# Altium schematic sheet PCI short card universal - 32 BIT-7.schdoc
size A3
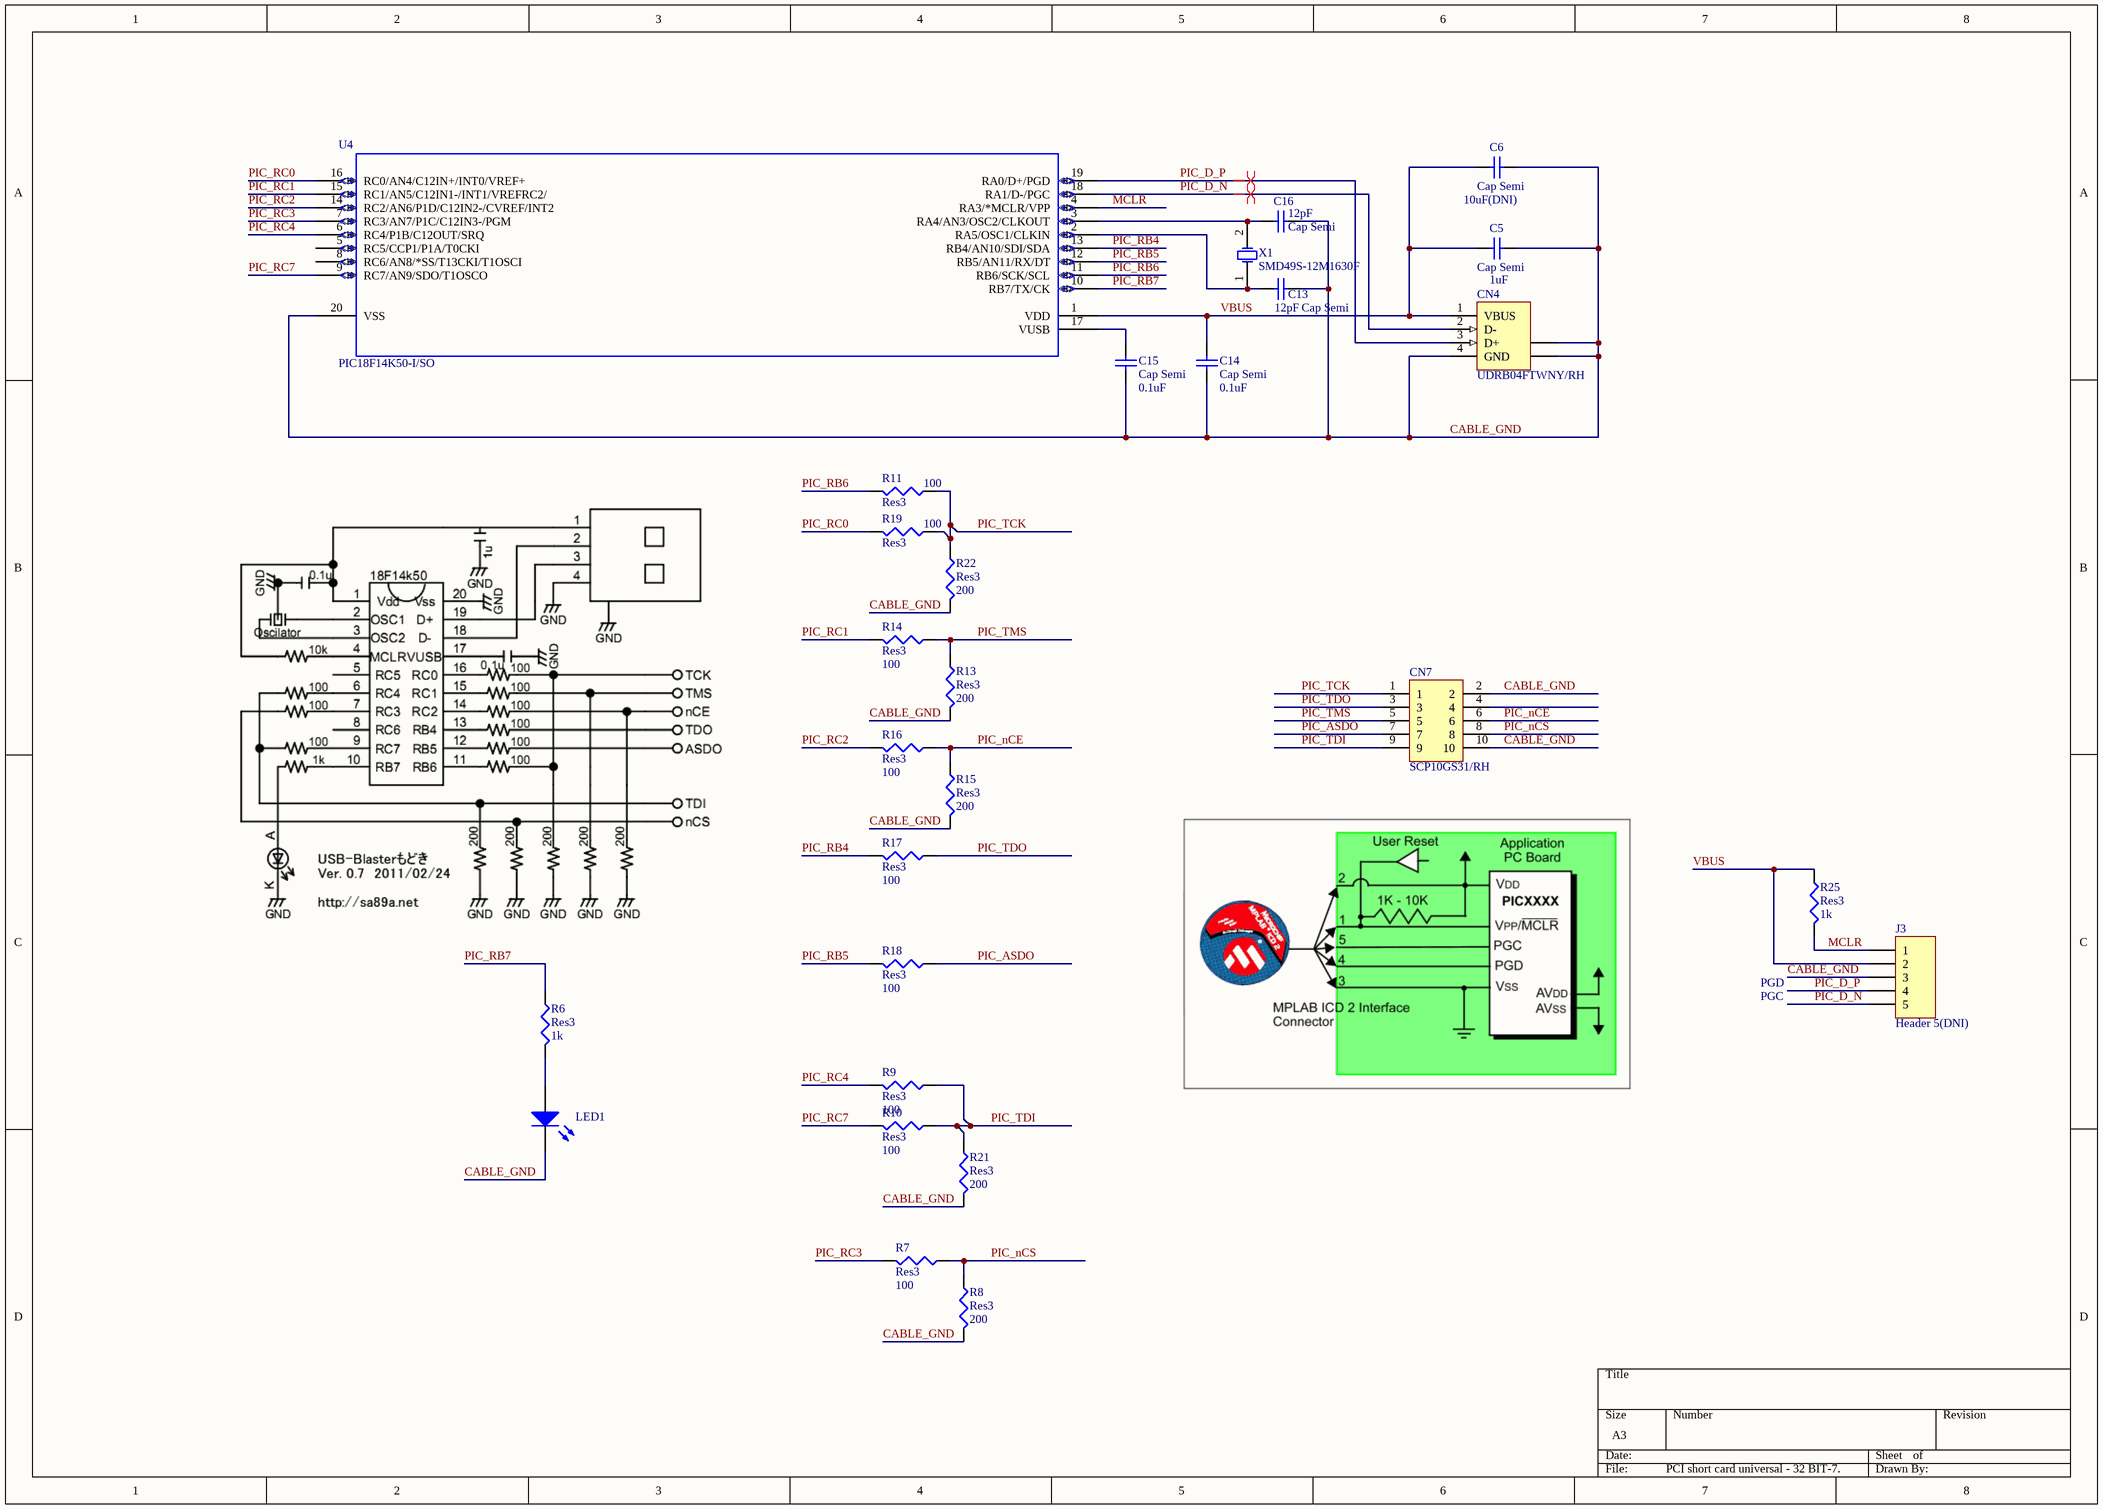
[diagram p0: PCI short card universal - 32 BIT-7.schdoc]

## Parts
C5  Cap Semi  value 1uF  [RESC1608N]
C6  Cap Semi  value 10uF(DNI)  [RESC2012N]
C13  Cap Semi  value 12pF  [RESC1608N]
C14  Cap Semi  value 0.1uF  [RESC1608N]
C15  Cap Semi  value 0.1uF  [RESC1608N]
C16  Cap Semi  value 12pF  [RESC1608N]
CN4  UDRB04FTWNY/RH  [1437106]
CN7  SCP10GS31/RH  [SCP10GS31/RH]
J3  Header 5(DNI)  [HDR1X5]
LED1  LED2  [LED3.2X1.6X1.1]  (value not drawn)
R6  Res3  value 1k  [RESC1608N]
R7  Res3  value 100  [RESC1608N]
R8  Res3  value 200  [RESC1608N]
R9  Res3  value 100  [RESC1608N]
R10  Res3  value 100  [RESC1608N]
R11  Res3  value 100  [RESC1608N]
R13  Res3  value 200  [RESC1608N]
R14  Res3  value 100  [RESC1608N]
R15  Res3  value 200  [RESC1608N]
R16  Res3  value 100  [RESC1608N]
R17  Res3  value 100  [RESC1608N]
R18  Res3  value 100  [RESC1608N]
R19  Res3  value 100  [RESC1608N]
R21  Res3  value 200  [RESC1608N]
R22  Res3  value 200  [RESC1608N]
R25  Res3  value 1k  [RESC1608N]
U4  PIC18F14K50-I/SO  [PIC18F14K50-SO]
X1  SMD49S-12M1630F  [ABLS-25.000MHZ-B2F-T]

## Nets
CABLE_GND: C5.1 C6.1 C13.1 C14.1 C15.1 C16.1 CN4.4(GND) CN4.5(SHLD) CN4.6(SHLD) CN7.2 CN7.10 J3.3 LED1.2(K) R8.2 R13.2 R15.2 R21.2 R22.2 U4.20(VSS)
MCLR: J3.1 R25.2 U4.4(RA3/*MCLR/VPP)
PIC_ASDO: CN7.7 R18.1
PIC_D_N: CN4.2(D-) J3.5 U4.18(RA1/D-/PGC)
PIC_D_P: CN4.3(D+) J3.4 U4.19(RA0/D+/PGD)
PIC_nCE: CN7.6 R15.1 R16.1
PIC_nCS: CN7.8 R7.1 R8.1
PIC_RB4: R17.2 U4.13(RB4/AN10/SDI/SDA)
PIC_RB5: R18.2 U4.12(RB5/AN11/RX/DT)
PIC_RB6: R11.2 U4.11(RB6/SCK/SCL)
PIC_RB7: R6.1 U4.10(RB7/TX/CK)
PIC_RC0: R19.2 U4.16(RC0/AN4/C12IN+/INT0/VREF+)
PIC_RC1: R14.2 U4.15(RC1/AN5/C12IN1-/INT1/VREFRC2/)
PIC_RC2: R16.2 U4.14(RC2/AN6/P1D/C12IN2-/CVREF/INT2)
PIC_RC3: R7.2 U4.7(RC3/AN7/P1C/C12IN3-/PGM)
PIC_RC4: R9.2 U4.6(RC4/P1B/C12OUT/SRQ)
PIC_RC7: R10.2 U4.9(RC7/AN9/SDO/T1OSCO)
PIC_TCK: CN7.1 R11.1 R19.1 R22.1
PIC_TDI: CN7.9 R9.1 R10.1 R21.1
PIC_TDO: CN7.3 R17.1
PIC_TMS: CN7.5 R13.1 R14.1
VBUS: C5.2 C6.2 C14.2 CN4.1(VBUS) J3.2 R25.1 U4.1(VDD)
NetC13_2: C13.2 U4.2(RA5/OSC1/CLKIN) X1.1(OSC1)
NetC15_2: C15.2 U4.17(VUSB)
NetC16_2: C16.2 U4.3(RA4/AN3/OSC2/CLKOUT) X1.2(OSC2)
NetLED1_1: LED1.1(A) R6.2

Not connected (* = marked no-connect by the designer): CN7 4; U4 5(RC5/CCP1/P1A/T0CKI) 8(RC6/AN8/*SS/T13CKI/T1OSCI)

## Layout directives
differential pair: PIC_D_N, PIC_D_P

## Notes on the sheet
- PGD
- PGC

## Library data of the parts
C5 C6 C13-C16 = Cap Semi: Capacitor (Semiconductor SIM Model); Published: 8-Jun-2000; LatestRevisionDate: 17-Jul-2002; LatestRevisionNote: Re-released for DXP Platform.; PackageReference: C1206; Publisher: Altium Limited
CN4 = 4-1437106-7: GTK; ContactMaterial: Copper Alloy; ContactPlating: Gold (30); TerminationLength: 2.90mm [0.114in.]; PCB_Layout: Complies with manufacturer's recommendation.; DrillSize: Corresponds to nominal value.; PanelGround: Without; Published: 15-Jul-2004; DatasheetDocument: 05-Jan-2004; PackageDocument: 05-Jan-2004; PackageReference: 1437106; Publisher: Altium Limited; HousingMaterial: Glass-Filled Thermoplastic; ComponentLink1Description: Manufacturer Link; ComponentLink1URL: http://www.tycoelectronics.com/; ComponentLink2Description: Packaging Specification; ComponentLink2URL: http://ecommas.tycoelectronics.com/commerce/DocumentDelivery/DDEController?Action=showdoc&DocId=Customer+Drawing%7F1437106%7FC%7Ftif%7FEnglish%7FENG_CD_1437106_C.tif
CN7 = SCP10GS31/RH: GTK
J3 = Header 5: Header, 5-Pin; LatestRevisionDate: 17-Jul-2002; LatestRevisionNote: Re-released for DXP Platform.; Publisher: Altium Limited
LED1 = LED2: OASISTEK (TO-3216BC-MAE); Published: 8-Jun-2000; LatestRevisionDate: 17-Jul-2002; LatestRevisionNote: Re-released for DXP Platform.; PackageDocument: Feb-2002; PackageReference: 3.2X1.6X1.1; Publisher: Altium Limited
R6-R11 R13-R19 R21 R22 R25 = Res3: Resistor; Published: 8-Jun-2000; LatestRevisionDate: 04-Mar-2005; LatestRevisionNote: PCB Footprint replaced.; PackageReference: J1-0603; Publisher: Altium Limited
U4 = PIC18F14K50: MICROCHIPS
X1 = ABLS-25.000MHZ-B2F-T: MEC